# EasyEDA schematic SCH_10.1HD_2021-11-26.json
TITLE: Sensor Board S1; REV: 1.0; Date: 2021-10-27; Sheet: 1/1; Drawn By: Tanish; Company: Chitkara University
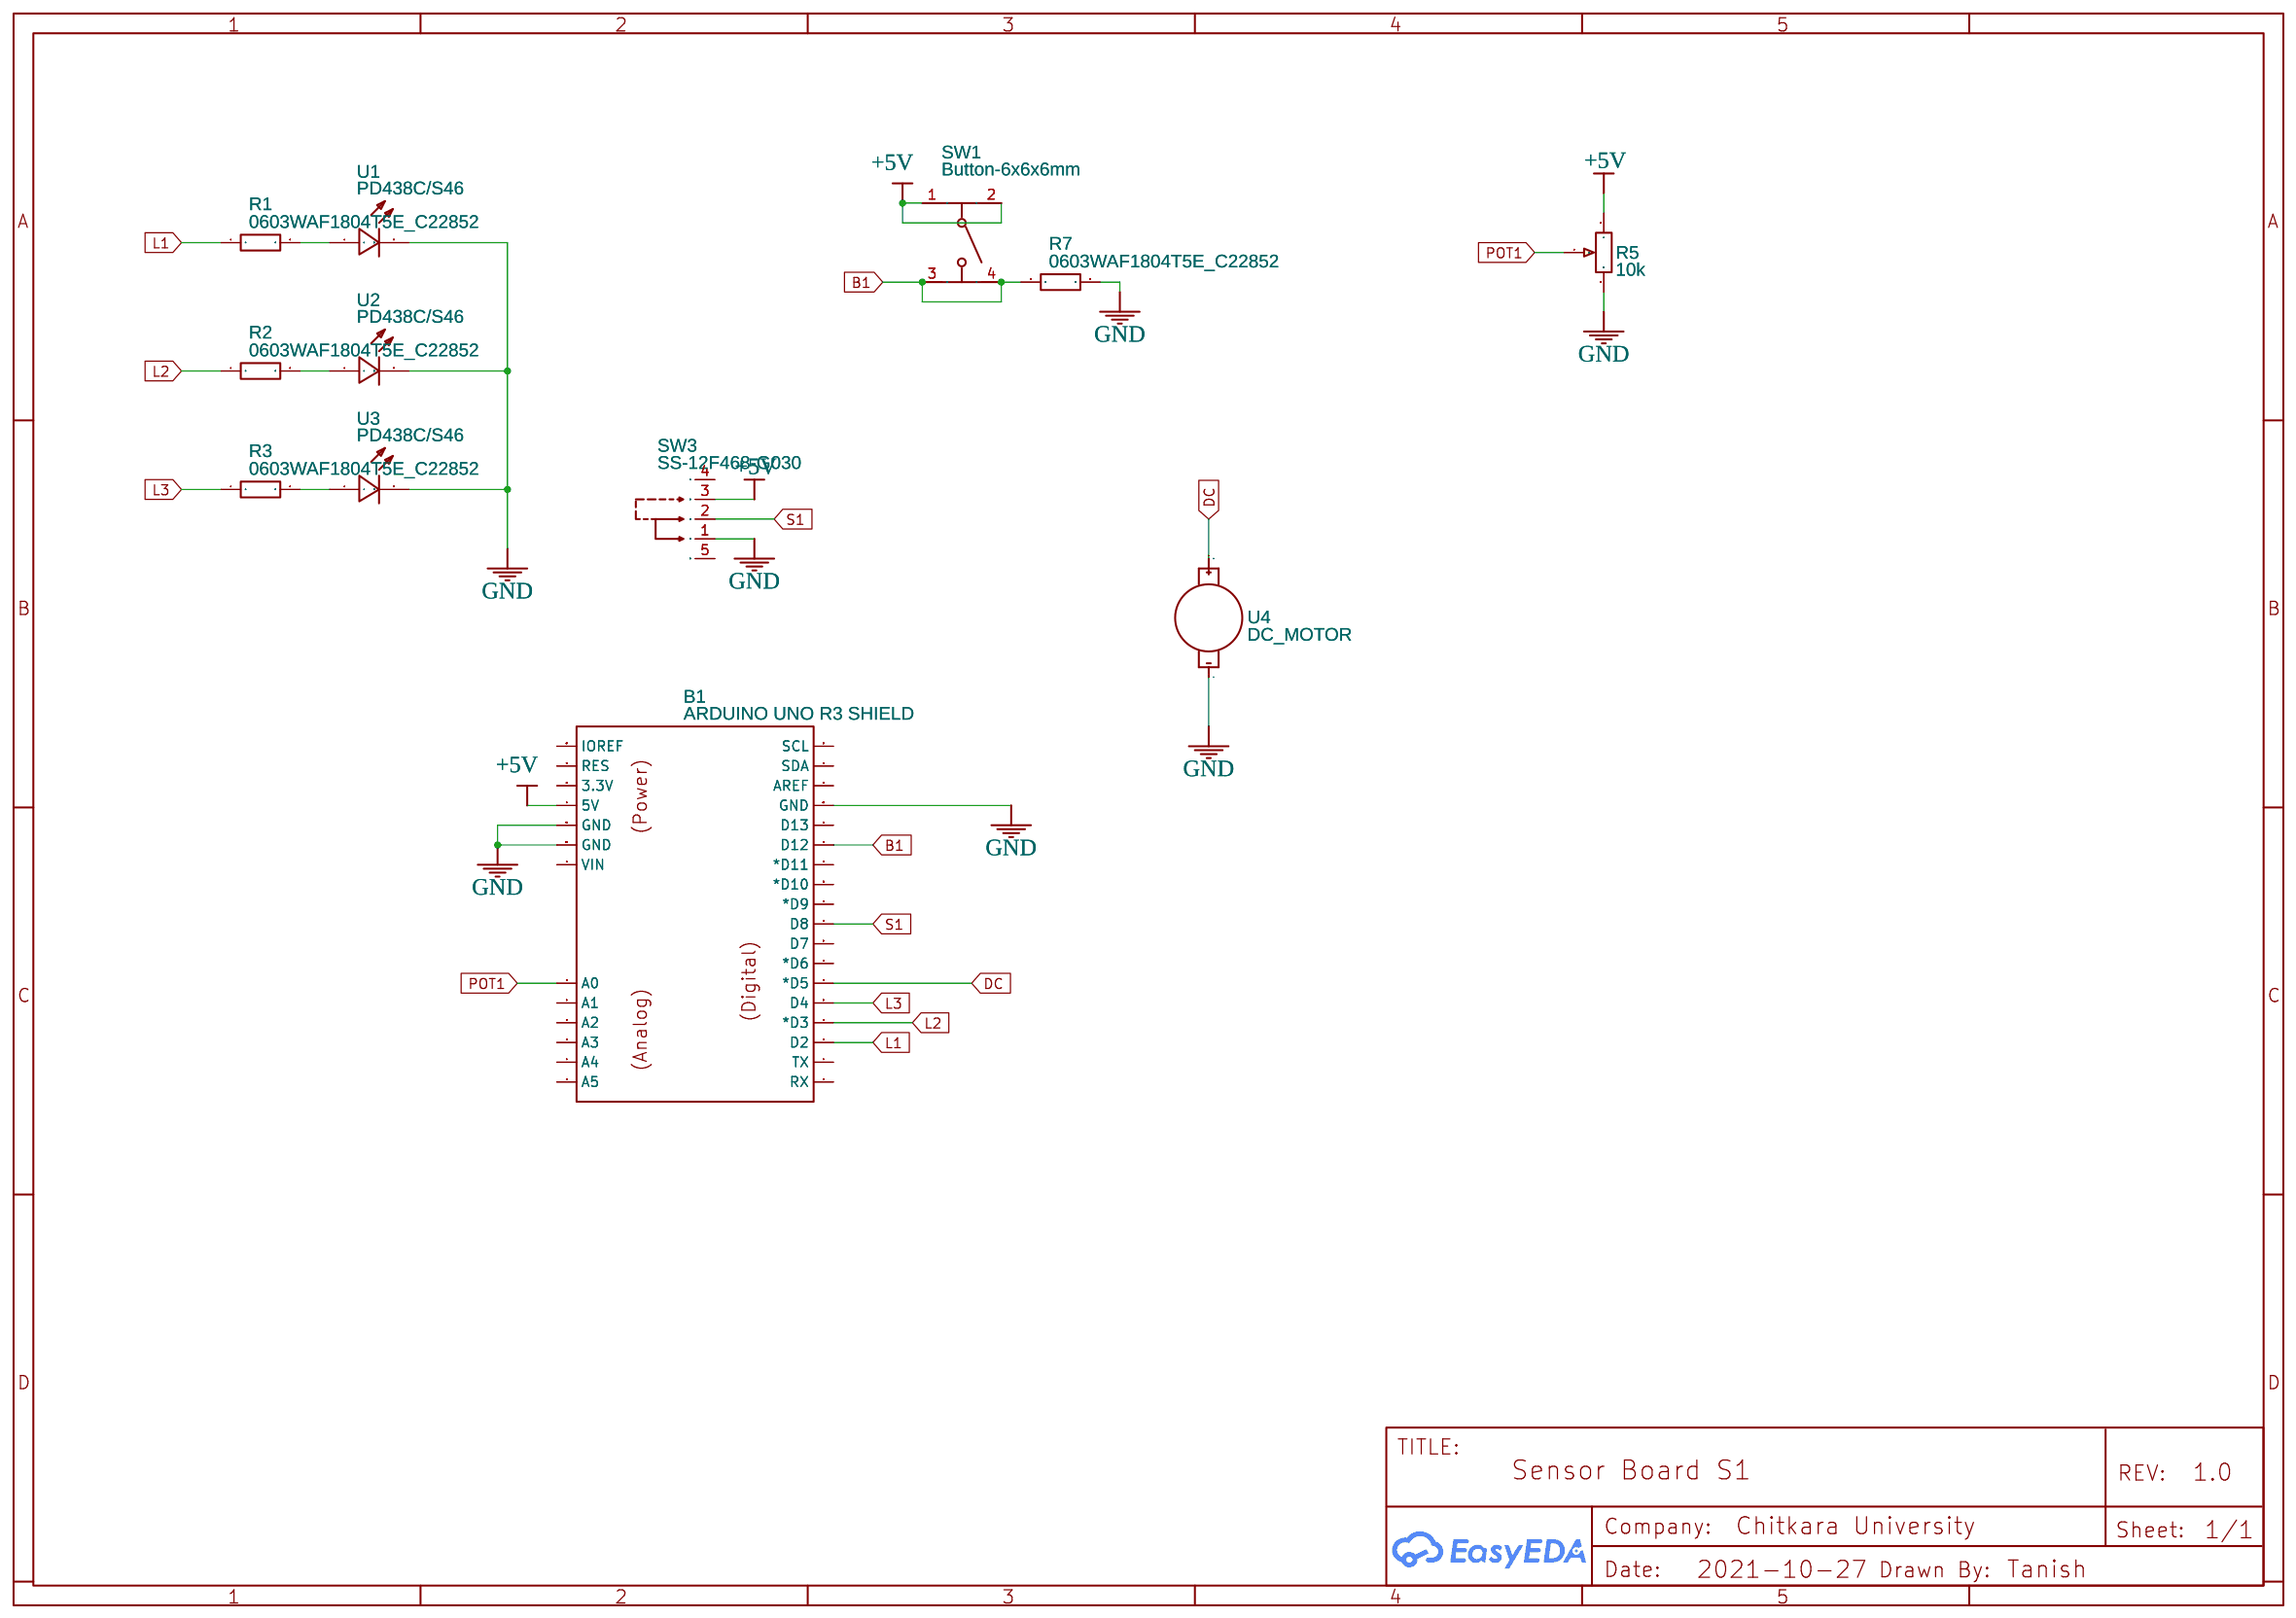
[diagram p0: schematic sheet]

## Parts
B1  ARDUINO UNO R3 SHIELD  [PKG-ARDUINO-UNO-R3-SHIELD]
R1  0603WAF1804T5E_C22852  [R0603]
R2  0603WAF1804T5E_C22852  [R0603]
R3  0603WAF1804T5E_C22852  [R0603]
R5  10k  [AS488DS3-SDF5]
R7  0603WAF1804T5E_C22852  [R0603]
SW1  Button-6x6x6mm  [SW-TH_4P-L6.0-W6.0-P4.50-LS6.1]
SW3  SS-12F468-G030  [SW-TH_G-SWITCH_SS-12F468-G030]
U1  PD438C/S46  [LED-TH_BD4.8-P2.54-FD]
U2  PD438C/S46  [LED-TH_BD4.8-P2.54-FD]
U3  PD438C/S46  [LED-TH_BD4.8-P2.54-FD]
U4  DC_MOTOR  [VIBE-MOTOR-10MM]

## Library data of the parts
B1 = ARDUINO UNO R3 SHIELD: Manufacturer: ?; Manufacturer Part: ?; Link: ?; Contributor: rgonzalez23
R1-R3 R7 = 0603WAF1804T5E_C22852: Supplier Part: C22852; Supplier: LCSC; Manufacturer: UniOhm; Manufacturer Part: 0603WAF1804T5E; JLCPCB Part Class: Extended Part
R5 = 3362F-1-103LF: Supplier: Digi-Key; Manufacturer: Panasonic Electronic Components; Supplier Part: 3362F-1-103LF-ND
SW1 = Button-6x6x6mm: Supplier Part: C71836; Supplier: LCSC; Manufacturer: BBJ; Manufacturer Part: Switch,6*6*6Plastic head,260G, 0.25mm,Straight line
SW3 = SS-12F468-G030: Supplier: LCSC; Supplier Part: C2848904; Manufacturer: G-Switch(品赞); Contributor: LCSC
U1-U3 = PD438C/S46: Supplier: LCSC; Manufacturer: EVERLIGHT; Contributor: LCSC; Supplier Part: C146238; JLCPCB Part Class: Extended Part
U4 = DC_MOTOR: Contributor: Gianluca Tenni

## Nets
+5V: B1.5V R5.1 SW1.1 SW1.2 SW3.3
GND: B1.GND@0(GND) B1.GND@1(GND) B1.GND@2(GND) R5.3 R7.2 SW3.1 U1.2(C) U2.2(C) U3.2(C) U4.-
B1: B1.D12 R7.1 SW1.3 SW1.4
DC: B1.D5(*D5) U4.+
L1: B1.D2 R1.1
L2: B1.D3(*D3) R2.1
L3: B1.D4 R3.1
POT1: B1.A0 R5.2
S1: B1.D8 SW3.2
Net-(R1-2): R1.2 U1.1(A)
Net-(R2-2): R2.2 U2.1(A)
Net-(R3-2): R3.2 U3.1(A)

Not connected (* = marked no-connect by the designer): B1 3.3V A1 A2 A3 A4 A5 AREF D6(*D6) D7 D9(*D9) D10(*D10) D11(*D11) D13 IOREF RES RX SCL SDA TX VIN; SW3 4 5
